# EasyEDA Pro project ProPrj_EasyHub r2.epro

# Schematic Schematic1
Board Name: Board1; Create Date: 2026-01-28; Page Name: P1; Project Name: EasyHub; Schematic Name: Schematic1; Update Date: 2026-01-28; Company: EasyEDA.com; Page Size: A4; Version: V1.0
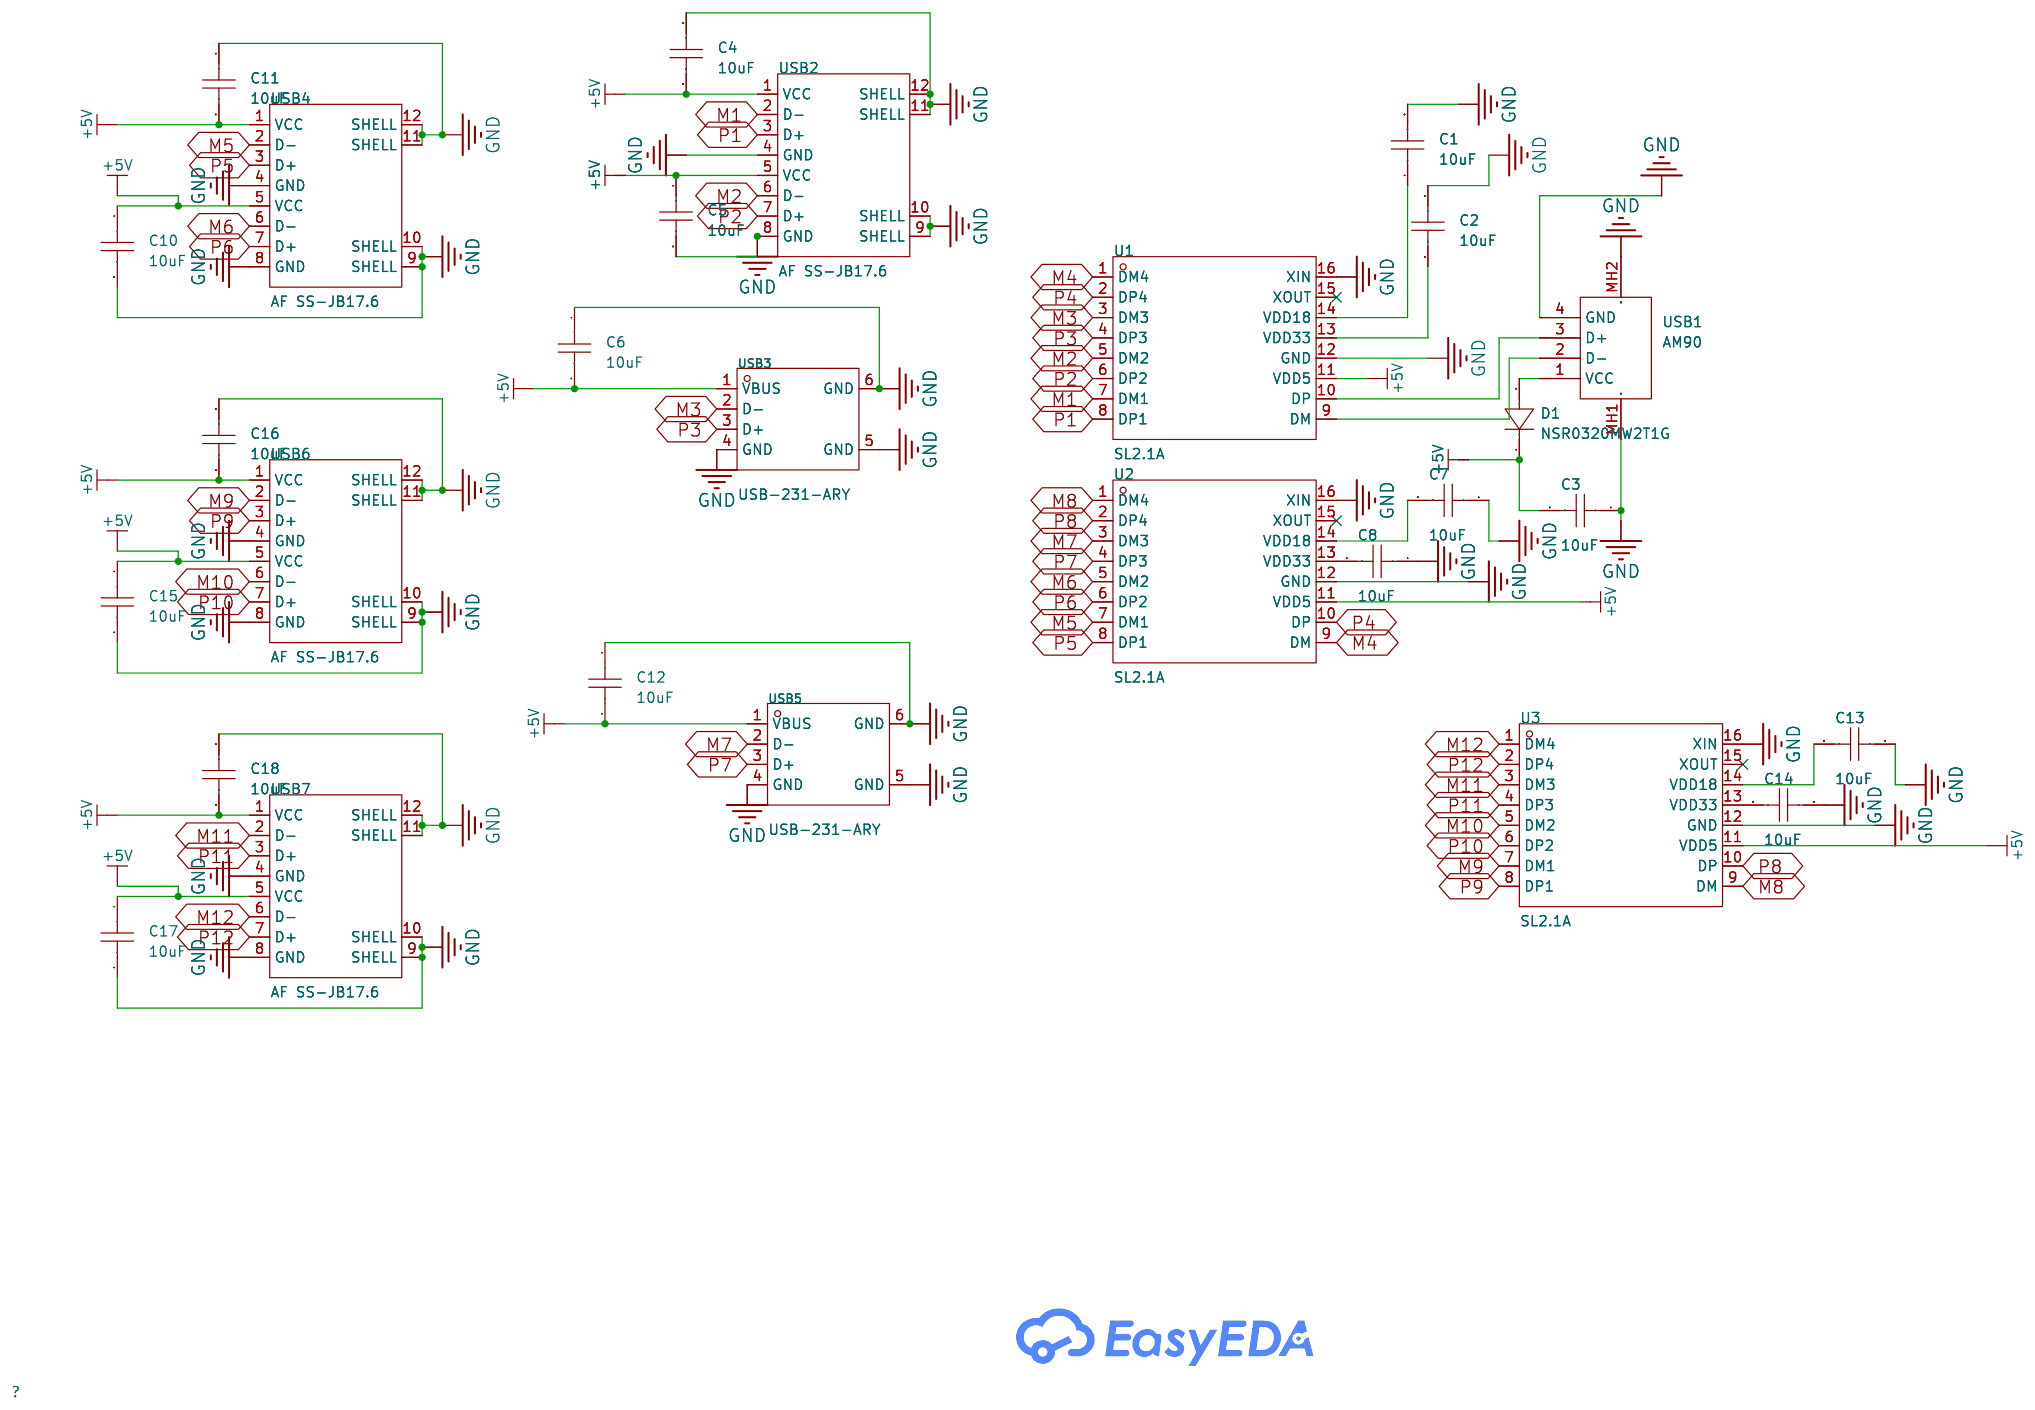
[diagram p0: schematic sheet]

## Parts
C1  10uF  [C0603]
C2  10uF  [C0603]
C3  10uF  [C0603]
C4  10uF  [C0603]
C5  10uF  [C0603]
C6  10uF  [C0603]
C7  10uF  [C0603]
C8  10uF  [C0603]
C10  10uF  [C0603]
C11  10uF  [C0603]
C12  10uF  [C0603]
C13  10uF  [C0603]
C14  10uF  [C0603]
C15  10uF  [C0603]
C16  10uF  [C0603]
C17  10uF  [C0603]
C18  10uF  [C0603]
D1  NSR0320MW2T1G  [SOD-323_L1.8-W1.3-LS2.5-RD]
U1  SL2.1A  [SOP-16_L10.0-W3.9-P1.27-LS6.0-BL]
U2  SL2.1A  [SOP-16_L10.0-W3.9-P1.27-LS6.0-BL]
U3  SL2.1A  [SOP-16_L10.0-W3.9-P1.27-LS6.0-BL]
USB1  AM90  [USB-AM-TH_AM90]
USB2  AF SS-JB17.6  [USB-A-TH_AF-SS-JB17.6]
USB3  USB-231-ARY  [USB-A-TH_USB-231-ARY]
USB4  AF SS-JB17.6  [USB-A-TH_AF-SS-JB17.6]
USB5  USB-231-ARY  [USB-A-TH_USB-231-ARY]
USB6  AF SS-JB17.6  [USB-A-TH_AF-SS-JB17.6]
USB7  AF SS-JB17.6  [USB-A-TH_AF-SS-JB17.6]

## Library data of the parts
C1-C8 C10-C18 = CL10A106KP8NNNC: Capacitance:10uF Tolerance:±10% Tolerance:±10% Voltage Rating:10V Temperature Coefficient:X5R; LCSC Part Name: 10uF ±10% 10V; Supplier Part: C19702; Manufacturer: SAMSUNG(三星); Supplier Footprint: 0603; JLCPCB Part Class: Basic Part; Datasheet: https://item.szlcsc.com/datasheet/CL10A106KP8NNNC/20411.html; Supplier: LCSC; Tolerance: ±10%; Voltage Rating: 10V; Temperature Coefficient: X5R
D1 = NSR0320MW2T1G: Voltage - Forward(Vf@If):500mV@900mA Voltage - DC Reverse(Vr):20V Current - Rectified:1A Reverse Leakage Current (Ir):50uA@15V Operating Junction Temperature Range:-55℃~+125℃ Operating Junction Temperature Range:-55℃~+125℃ Non-Repetitive Peak Forward Surg; LCSC Part Name: 电压:20V 电流:1A; Supplier Part: C48192; Manufacturer: onsemi(安森美); Supplier Footprint: SOD-323; JLCPCB Part Class: Extended Part; Datasheet: https://item.szlcsc.com/datasheet/NSR0320MW2T1G/49199.html; Supplier: LCSC; Voltage - Forward(Vf@If): 500mV@900mA; Voltage - DC Reverse(Vr): 20V; Current - Rectified: 1A; Reverse Leakage Current (Ir): 50uA@15V; Operating Junction Temperature Range: -55℃~+125℃; Non-Repetitive Peak Forward Surge Current: 5A
U1-U3 = SL2.1A_C6798314: Supplier Part: C6798314; Manufacturer: CoreChips(和芯润德); Supplier Footprint: SOP-16; JLCPCB Part Class: Extended Part; Datasheet: https://item.szlcsc.com/datasheet/SL2.1A/7757919.html; Supplier: LCSC
USB1 = AM90: Connector Type:Type-A Protocol Standard:USB 2.0 Gender:Male Mounting Type:Right Angle Number of Contacts:4P Number of Ports:1 Current Rating-Power:1.5A Voltage Rating:30V Connect-Disconnect Life:5,000 times Supplementary Features:- Center Height:- Length:; LCSC Part Name: Type-A弯插公头; Supplier Part: C404965; Manufacturer: SHOU HAN(首韩); Supplier Footprint: 弯插; JLCPCB Part Class: Extended Part; Datasheet: https://item.szlcsc.com/datasheet/AM90/392530.html; Supplier: LCSC; Connector Type: Type-A; Protocol Standard: USB 2.0; Gender: Male; Mounting Type: Right Angle; Number of Contacts: 4P; Number of Ports: 1; Current Rating-Power: 1.5A; Voltage Rating: 30V; Connect-Disconnect Life: 5,000 times; Length: 18.8mm; Detection color: White; Operating Temperature: -25℃~+85℃
USB2 USB4 USB6 USB7 = AF SS-JB17.6: Connector Type:Type-A Protocol Standard:USB 2.0 Gender:Female Mounting Type:Right Angle Number of Contacts:4Px2 Number of Ports:2 Current Rating-Power:1.5A Voltage Rating:30V Connect-Disconnect Life:5,000 times Supplementary Features:- Center Height:- Len; LCSC Part Name: Type-A弯插双层母座; Supplier Part: C456021; Manufacturer: SHOU HAN(首韩); Supplier Footprint: 弯插; JLCPCB Part Class: Extended Part; Datasheet: https://item.szlcsc.com/datasheet/AF%2520SS-JB17.6/458828.html; Supplier: LCSC; Connector Type: Type-A; Protocol Standard: USB 2.0; Gender: Female; Mounting Type: Right Angle; Number of Contacts: 4Px2; Number of Ports: 2; Current Rating-Power: 1.5A; Voltage Rating: 30V; Connect-Disconnect Life: 5,000 times; Length: 17.6mm; Detection color: White; Operating Temperature: -25℃~+85℃
USB3 USB5 = USB-231-ARY: Connector Type:Type-A Protocol Standard:USB 2.0 Gender:Female Mounting Type:Right Angle Number of Contacts:4P Number of Ports:1 Current Rating-Power:1.5A Voltage Rating:30V Length:14.2mm Detection color:White Operating Temperature:-20℃~+70℃ Operating Temp; LCSC Part Name: Type-A 母 弯插; Supplier Part: C720525; Manufacturer: XUNPU(讯普); Supplier Footprint: 弯插; JLCPCB Part Class: Extended Part; Datasheet: https://item.szlcsc.com/datasheet/USB-231-ARY/763532.html; Supplier: LCSC; Connector Type: Type-A; Protocol Standard: USB 2.0; Gender: Female; Mounting Type: Right Angle; Number of Contacts: 4P; Number of Ports: 1; Current Rating-Power: 1.5A; Voltage Rating: 30V; Length: 14.2mm; Detection color: White; Operating Temperature: -20℃~+70℃

## Nets
+5V: C3.2 C4.2 C5.1 C6.2 C10.1 C11.2 C12.2 C15.1 C16.2 C17.1 C18.2 D1.1(K) U1.11(VDD5) U2.11(VDD5) U3.11(VDD5) USB2.1(VCC) USB2.5(VCC) USB3.1(VBUS) USB4.1(VCC) USB4.5(VCC) USB5.1(VBUS) USB6.1(VCC) USB6.5(VCC) USB7.1(VCC) USB7.5(VCC)
GND: C1.2 C2.1 C3.1 C4.1 C5.2 C6.1 C7.1 C8.1 C10.2 C11.1 C12.1 C13.1 C14.1 C15.2 C16.1 C17.2 C18.1 U1.12(GND) U1.16(XIN) U2.12(GND) U2.16(XIN) U3.12(GND) U3.16(XIN) USB1.4(GND) USB1.MH1 USB1.MH2 USB2.4(GND) USB2.8(GND) USB2.9(SHELL) USB2.10(SHELL) USB2.11(SHELL) USB2.12(SHELL) USB3.4(GND) USB3.5(GND) USB3.6(GND) USB4.4(GND) USB4.8(GND) USB4.9(SHELL) USB4.10(SHELL) USB4.11(SHELL) USB4.12(SHELL) USB5.4(GND) USB5.5(GND) USB5.6(GND) USB6.4(GND) USB6.8(GND) USB6.9(SHELL) USB6.10(SHELL) USB6.11(SHELL) USB6.12(SHELL) USB7.4(GND) USB7.8(GND) USB7.9(SHELL) USB7.10(SHELL) USB7.11(SHELL) USB7.12(SHELL)
M1: U1.7(DM1) USB2.2(D-)
M2: U1.5(DM2) USB2.6(D-)
M3: U1.3(DM3) USB3.2(D-)
M4: U1.1(DM4) U2.9(DM)
M5: U2.7(DM1) USB4.2(D-)
M6: U2.5(DM2) USB4.6(D-)
M7: U2.3(DM3) USB5.2(D-)
M8: U2.1(DM4) U3.9(DM)
M9: U3.7(DM1) USB6.2(D-)
M10: U3.5(DM2) USB6.6(D-)
M11: U3.3(DM3) USB7.2(D-)
M12: U3.1(DM4) USB7.6(D-)
P1: U1.8(DP1) USB2.3(D+)
P2: U1.6(DP2) USB2.7(D+)
P3: U1.4(DP3) USB3.3(D+)
P4: U1.2(DP4) U2.10(DP)
P5: U2.8(DP1) USB4.3(D+)
P6: U2.6(DP2) USB4.7(D+)
P7: U2.4(DP3) USB5.3(D+)
P8: U2.2(DP4) U3.10(DP)
P9: U3.8(DP1) USB6.3(D+)
P10: U3.6(DP2) USB6.7(D+)
P11: U3.4(DP3) USB7.3(D+)
P12: U3.2(DP4) USB7.7(D+)
$1N764: U1.10(DP) USB1.3(D+)
$1N770: U1.9(DM) USB1.2(D-)
$1N1165: C1.1 U1.14(VDD18)
$1N1196: C2.2 U1.13(VDD33)
$1N1363: D1.2(A) USB1.1(VCC)
$1N2180: C7.2 U2.14(VDD18)
$1N2340: C8.2 U2.13(VDD33)
$1N5208: C14.2 U3.13(VDD33)
$1N5214: C13.2 U3.14(VDD18)

Not connected (* = marked no-connect by the designer): U1 15(XOUT)*; U2 15(XOUT)*; U3 15(XOUT)*

# Board PCB1
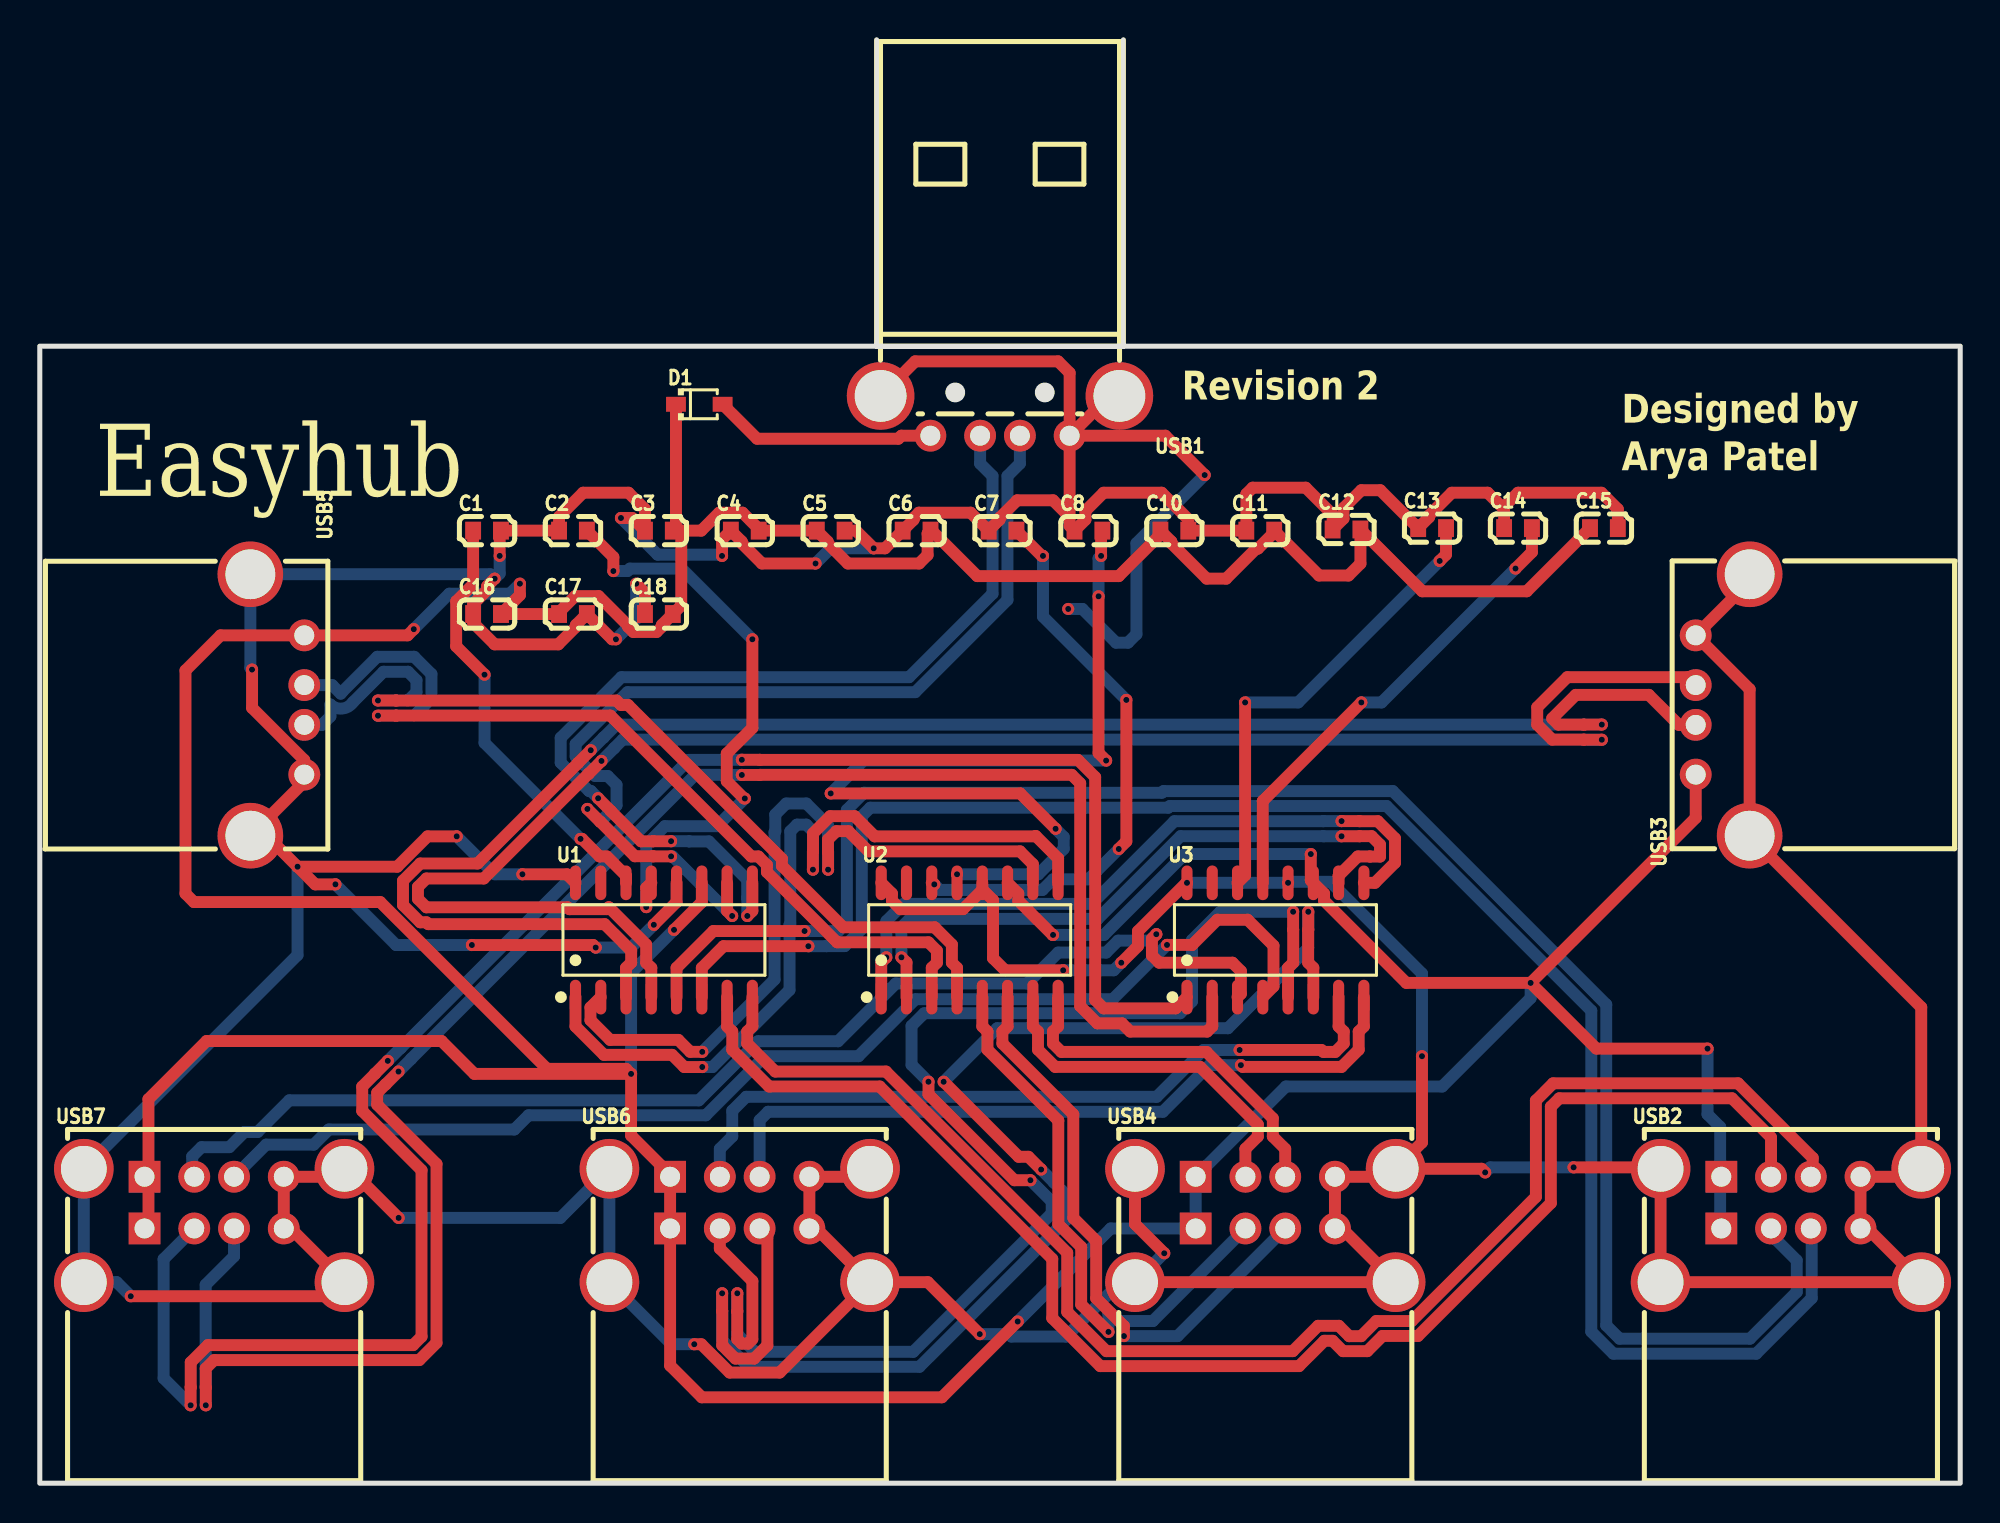
[diagram p1: board, top side]
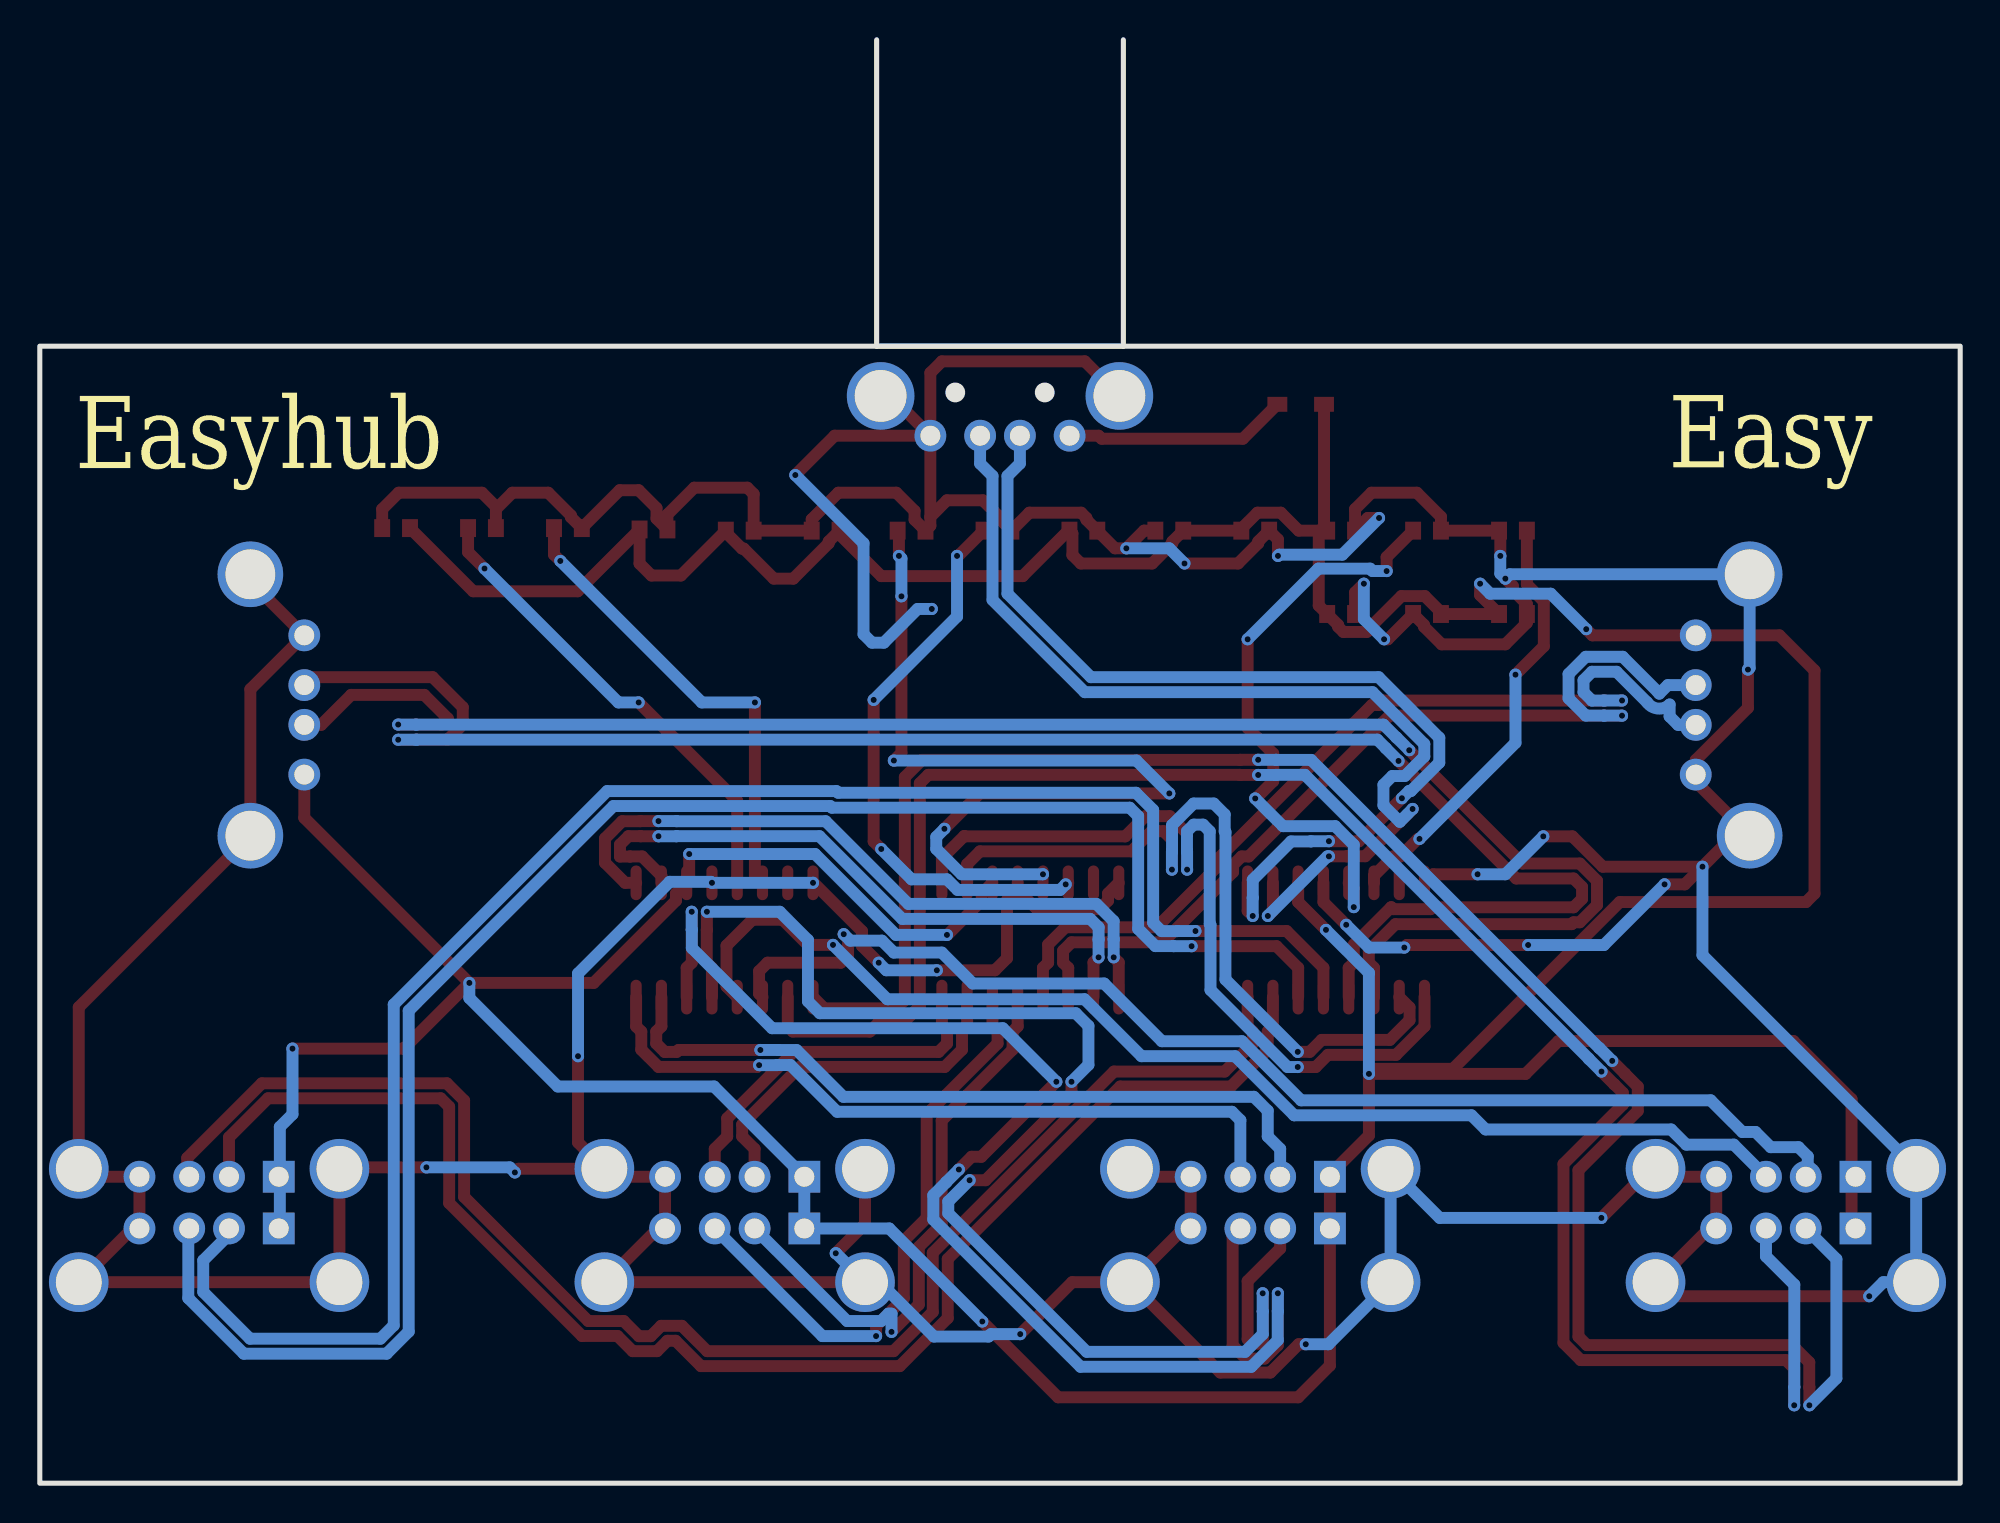
[diagram p2: board, bottom side, seen from below]

Outline 96.52 x 72.55 mm; copper layers: Top Layer, Bottom Layer. Coordinates in mm from the lower left corner of the outline.
Outline path: rectangle 0,57.15 96.52,0
Stack: Top Layer 0.035mm / Dielectric1 1.51mm FR4 er 4.5 / Bottom Layer 0.035mm

## Design rules (mm)
net M4: DP14
net P4: DP14
net M3: DP12
net P3: DP12
net M2: DP9
net P2: DP9
net M1: DP8
net P1: DP8
net $1N764: DP13
net $1N770: DP13
net M8: DP5
net P8: DP5
net M7: DP4
net P7: DP4
net M6: DP3
net P6: DP3
net M5: DP2
net P5: DP2
net M12: DP11
net P12: DP11
net M11: DP10
net P11: DP10
net M10: DP7
net P10: DP7
net M9: DP6
net P9: DP6
template: Custom Config
spacing copperThickness1oz (default): track to track 0.102, other pairs 0.152 to 0.3
spacing copperThickness2oz: track to track 0.203, other pairs 0.152 to 0.3
track width copperThickness1oz (default): min 0.127, default 0.254, max 2.54
track width copperThickness2oz: min 0.203, default 0.254, max 2.54
differential pair differentialPair (default): width min 0.127, default 0.254, max 2.54; gap min 0.152, default 0.152
via viaSize (default): diameter min 0.5, default 0.61, max 10; hole min 0.3, default 0.305, max 6.3

## Placement (name value [footprint] x y rotation side)
C1  10uF  [C0603]  22.48 47.88 0 top
C2  10uF  [C0603]  26.8 47.88 0 top
C3  10uF  [C0603]  31.12 47.88 0 top
C4  10uF  [C0603]  35.43 47.88 0 top
C5  10uF  [C0603]  39.75 47.88 0 top
C6  10uF  [C0603]  44.07 47.88 0 top
C7  10uF  [C0603]  48.39 47.88 0 top
C8  10uF  [C0603]  52.71 47.88 0 top
C10  10uF  [C0603]  57.02 47.88 0 top
C11  10uF  [C0603]  61.34 47.88 0 top
C12  10uF  [C0603]  65.68 47.94 0 top
C13  10uF  [C0603]  69.98 48.01 0 top
C14  10uF  [C0603]  74.3 48.01 0 top
C15  10uF  [C0603]  78.61 48.01 0 top
C16  10uF  [C0603]  22.48 43.69 0 top
C17  10uF  [C0603]  26.8 43.69 0 top
C18  10uF  [C0603]  31.12 43.69 0 top
D1  NSR0320MW2T1G  [SOD-323_L1.8-W1.3-LS2.5-RD]  33.15 54.23 0 top
U1  SL2.1A  [SOP-16_L10.0-W3.9-P1.27-LS6.0-BL]  31.37 27.3 0 top
U2  SL2.1A  [SOP-16_L10.0-W3.9-P1.27-LS6.0-BL]  46.74 27.3 0 top
U3  SL2.1A  [SOP-16_L10.0-W3.9-P1.27-LS6.0-BL]  62.1 27.3 0 top
USB1  AM90  [USB-AM-TH_AM90]  48.26 53.65 180 top
USB2  AF SS-JB17.6  [USB-A-TH_AF-SS-JB17.6]  88.01 12.95 0 top
USB3  USB-231-ARY  [USB-A-TH_USB-231-ARY]  84.58 39.12 90 top
USB4  AF SS-JB17.6  [USB-A-TH_AF-SS-JB17.6]  61.59 12.95 0 top
USB5  USB-231-ARY  [USB-A-TH_USB-231-ARY]  11.94 39.12 270 top
USB6  AF SS-JB17.6  [USB-A-TH_AF-SS-JB17.6]  35.18 12.95 0 top
USB7  AF SS-JB17.6  [USB-A-TH_AF-SS-JB17.6]  8.76 12.95 0 top

## Footprints (pads in the part's own frame, mm; a bottom-side part is the same pattern mirrored in y, then rotated)
C0603
  rect 0.8x0.9 smd: 1(-0.7,0) 2(0.7,0)
SOD-323_L1.8-W1.3-LS2.5-RD
  rect 1x0.75 smd: 1(-1.173,0) 2(1.173,0)
SOP-16_L10.0-W3.9-P1.27-LS6.0-BL
  oval 0.56x1.745 smd: 1(-4.445,-2.873) 2(-3.175,-2.873) 3(-1.905,-2.873) 4(-0.635,-2.873) 5(0.635,-2.873) 6(1.905,-2.873) 7(3.175,-2.873) 8(4.445,-2.873) 9(4.445,2.873) 10(3.175,2.873) 11(1.905,2.873) 12(0.635,2.873) 13(-0.635,2.873) 14(-1.905,2.873) 15(-3.175,2.873) 16(-4.445,2.873)
USB-A-TH_AF-SS-JB17.6
  rect 1.6x1.6 hole 1: 1(-3.5,2.45) 5(-3.5,-0.15)
  round 1.6 hole 1: 2(-1,2.45) 3(1,2.45) 4(3.5,2.45) 6(-1,-0.15) 7(1,-0.15) 8(3.5,-0.15)
  round 3 hole 2.3: 9(-6.55,2.85) 10(6.55,2.85) 11(-6.55,-2.85) 12(6.55,-2.85)
USB-A-TH_USB-231-ARY
  round 1.6 hole 1: 1(-3.5,1.355) 2(-1,1.355) 3(1,1.355) 4(3.5,1.355)
  round 3.3 hole 2.5: 5(-6.57,-1.355) 6(6.57,-1.355)
USB-AM-TH_AM90
  round 1.6 hole 1: 1(3.5,1) 2(1,1) 3(-1,1) 4(-3.5,1)
  round 3.4 hole 2.6: MH1(6,-1) MH2(-6,-1)

## Nets
As in the schematic.

Pads without a net: U1 15; U2 15; U3 15

## Via types
v1: diameter 0.61, hole 0.305, Top Layer to Bottom Layer, 101 vias

## Routing (per net, layer and track width the routed paths; a pad name or vN(x,y) marks a point on that pad's centre or on a via; arc(x,y) is an arc through that point)
+5V: length 317.7
  Top Layer w0.6: v1(24.13,45.21) 24.13,44.64 C16.2 C17.1 26.1,43.78 26.91,44.59 28.08,44.59 29.56,43.11 29.56,43.05 29.83,42.79 31,42.79 31.27,43.05 31.27,43.14 C18.2 32.24,44.11 32.24,47.88 ; v1(74.93,25.15) 68.68,25.15 64.55,29.28 64.55,29.64 U3.11 63.88,30.3 v1(63.88,31.62) ; v1(74.93,25.15) 83.23,33.44 USB3.1 ; v1(74.93,25.15) 78.23,21.84 v1(83.82,21.84) ; C15.1 74.74,44.83 69.48,44.83 C12.2 66.38,46.22 65.78,45.62 64.3,45.62 C11.2 62.04,47.79 61.23,46.98 61.14,46.98 59.63,45.47 58.65,45.47 56.87,47.24 56.87,47.33 C10.1 56.32,47.69 54.23,45.59 47.12,45.59 44.83,47.88 C6.2 44.62,47.73 44.62,46.65 44.2,46.23 40.61,46.23 39.6,47.24 39.6,47.33 C5.1 C4.2 36.13,47.97 35.32,48.78 34.15,48.78 33.24,47.88 32.24,47.88 ; 32.24,47.88 C3.2 31.97,48.04 D1.1 ; v1(29.72,20.57) 29.72,17.48 31.68,15.51 USB6.5 31.68,5.91 33.27,4.32 45.34,4.32 v1(49.15,8.13) ; v1(29.72,20.57) 21.84,20.57 20.19,22.22 8.38,22.22 5.46,19.3 5.46,13 USB7.5 ; v1(29.72,20.57) 29.46,20.83 25.49,20.83 17.11,29.21 7.75,29.21 7.32,29.63 7.32,40.85 9.09,42.62 USB5.1 18.49,42.62 v1(18.8,42.93) ; 48.64,30.18 49.18,29.64 49.18,29.28 50.9,27.56 v1(50.93,27.56) ; U1.11 33.27,29.21 v1(31.88,27.81)
  Bottom Layer w0.6: v1(31.88,27.81) 29.72,25.65 v1(29.72,20.57) ; v1(18.8,42.93) 20.58,44.71 23.63,44.71 v1(24.13,45.21) ; v1(83.82,21.84) 83.82,18.54 84.46,17.91 84.46,12.86 USB2.5 ; v1(50.93,27.56) 53.49,27.56 57.55,31.62 v1(63.88,31.62) ; v1(49.15,8.13) 53.83,12.8 USB4.5 58.09,15.4 62.63,19.94 70.49,19.94 74.93,24.38 v1(74.93,25.15)
GND: length 476.7
  Top Layer w0.6: 73.59,48.96 73.59,49.08 74.3,49.78 78.49,49.78 79.31,48.96 C15.2 ; 73.59,48.96 72.77,49.78 70.97,49.78 69.83,48.64 69.83,48.55 C13.1 67.37,49.91 66.42,49.91 65.52,49.01 65.52,48.48 C12.1 64.98,48.69 63.63,50.04 60.96,50.04 60.64,49.72 60.64,47.88 57.72,47.88 57.72,48.45 56.39,49.78 53.47,49.78 52.55,48.87 52.55,48.43 52,47.88 51.76,48.12 51.76,48.57 ; 73.59,48.96 C14.1 ; USB1.4 53.76,54.65 USB1.MH2 ; USB1.4 51.76,55.81 51.18,56.39 44,56.39 USB1.MH1 ; USB1.4 51.76,48.57 ; USB1.4 56.57,52.65 v1(58.55,50.67) ; v1(29.21,48.51) 29.78,48.51 30.41,47.88 30.41,48.96 29.59,49.78 27.31,49.78 26.1,48.58 C2.1 C1.2 23.11,47.81 v1(23.11,46.61) ; C5.2 41.02,47.88 v1(41.91,46.99) 42.48,46.99 43.92,48.43 43.92,48.52 44.18,48.78 46.78,48.78 C7.1 48.24,48.43 48.24,48.52 49.12,49.4 50.93,49.4 51.76,48.57 ; v1(12.95,30.99) 11.4,32.55 USB5.6 13.29,35.26 USB5.4 13.29,36.35 10.67,38.97 v1(10.67,40.89) ; v1(12.95,30.99) 13.84,30.1 v1(14.86,30.1) ; v1(12.95,30.99) 17.97,30.99 19.49,32.51 v1(20.95,32.51) ; USB4.10 72.46,15.8 v1(72.64,15.62) ; USB4.10 67.75,15.4 65.09,15.4 65.09,13.15 USB4.12 USB4.11 ; USB4.10 69.47,17.13 v1(69.47,21.46) ; v1(21.72,27.05) 27.81,27.05 v1(27.94,26.92) ; v1(57.66,30.18) 57.63,30.18 55.19,27.74 55.19,27 v1(54.36,26.16) ; USB6.12 44.63,10.1 v1(47.24,7.49) ; USB6.12 38.68,13.15 38.68,15.4 41.33,15.4 USB6.10 ; USB6.12 37.19,5.56 34.67,5.56 33.25,6.98 v1(32.89,6.98) ; U2.12 47.37,29.84 ; 47.37,29.84 47.91,29.31 47.91,26.39 48.51,25.78 v1(51.44,25.78) ; 47.37,29.84 47.37,29.82 46.4,28.85 43.26,28.85 42.83,29.28 42.83,29.64 U2.16 ; 30.41,43.69 30.41,44.77 v1(29.97,45.21) ; USB4.9 55.05,13.03 v1(56.52,11.56) ; 85.94,45.69 85.94,45.33 USB3.4 85.94,39.91 USB3.5 94.56,23.92 USB2.10 94.16,15.4 91.51,15.4 91.51,13.15 USB2.12 USB2.11 USB2.9 81.39,15.87 v1(77.09,15.87) ; U1.16 26.49,30.61 v1(24.26,30.61) ; v1(30.86,28.07) 32,29.21 U1.12 ; v1(28.96,42.42) 28.77,42.42 27.5,43.69 26.95,43.14 26.95,43.05 26.06,42.16 22.86,42.16 21.78,43.24 21.78,44.18 22.48,44.89 22.48,45.09 v1(22.86,45.47) ; v1(34.29,46.61) 34.29,47.44 C4.1 35.28,47.33 35.28,47.24 36.3,46.23 v1(38.99,46.23) ; v1(18.03,13.33) 15.56,15.8 USB7.10 14.91,15.4 12.26,15.4 12.26,13.15 USB7.12 14.61,9.4 v1(4.57,9.4)
  Bottom Layer w0.6: v1(58.55,50.67) 55.12,47.24 55.12,42.67 54.69,42.25 54.09,42.25 52.4,43.94 v1(51.69,43.94) ; v1(38.99,46.23) 39.75,46.99 v1(41.91,46.99) ; v1(34.29,46.61) 34.23,46.67 31.05,46.67 v1(29.21,48.51) ; v1(77.09,15.87) 72.9,15.87 v1(72.64,15.62) ; v1(21.72,27.05) 17.91,27.05 v1(14.86,30.1) ; v1(30.86,28.07) 29.72,26.92 v1(27.94,26.92) ; v1(29.97,45.21) 29.97,43.43 v1(28.96,42.42) ; v1(23.11,46.61) 23.11,45.72 v1(22.86,45.47) 22.64,45.69 10.58,45.69 10.58,40.98 v1(10.67,40.89) ; v1(20.95,32.51) 22.86,30.61 v1(24.26,30.61) ; v1(32.89,6.98) 31.75,6.98 USB6.11 USB6.9 26.16,13.33 v1(18.03,13.33) ; v1(69.47,21.46) 69.47,25.62 64.86,30.23 62.79,30.23 v1(62.74,30.18) v1(57.66,30.18) ; v1(54.36,26.16) 53.97,25.78 v1(51.44,25.78) ; v1(12.95,30.99) 12.95,26.54 USB7.9 USB7.11 3.87,10.1 v1(4.57,9.4) ; v1(47.24,7.49) 48.71,7.49 48.84,7.37 51.58,7.37 54.31,10.1 USB4.11 56.5,11.56 v1(56.52,11.56)
M1: length 74.9
  Top Layer w0.6: 87.01,15.4 87.01,17.38 85.05,19.35 76.37,19.35 75.95,18.92 75.95,14.08 69.27,7.4 67.48,7.4 66.72,6.64 65.5,6.64 64.98,7.16 64.56,7.16 63.29,5.89 53.3,5.89 50.89,8.3 50.89,11.27 42.22,19.94 36.65,19.94 34.8,21.79 34.8,22.7 34.54,22.96 U1.7
M2: length 90.3
  Top Layer w0.6: U1.5 32,25.9 33.85,27.75 v1(38.44,27.75)
  Bottom Layer w0.6: v1(38.44,27.75) 39.34,27.75 39.35,27.75 40.14,27.75 40.56,28.17 40.56,33.84 41.43,34.7 56.4,34.7 56.48,34.79 68,34.79 78.73,24.06 78.73,7.93 79.4,7.26 85.96,7.26 88.3,9.61 88.3,11.2 87.01,12.49 USB2.6
M3: length 90.5
  Top Layer w0.6: U1.3 29.46,25.9 29.72,26.16 29.72,26.76 28.39,28.1 19.52,28.1 19.43,28.19 19.12,28.19 18.25,29.06 18.25,30.28 19.12,31.15 22,31.15 27.05,36.19 27.05,36.2 v1(27.69,36.84) ; USB3.2 82.38,38.12 80.87,39.62 77.2,39.62 76.01,38.44 76.33,38.13 77.6,38.13 77.6,38.13 v1(78.51,38.13)
  Bottom Layer w0.6: v1(78.51,38.13) 77.6,38.13 77.6,38.13 28.98,38.13 28.34,37.48 28.33,37.48 v1(27.69,36.84)
M4: length 42.6
  Top Layer w0.6: v1(33.3,20.92) 32.39,20.92 31.78,21.53 28.35,21.53 26.92,22.96 U1.1 ; U2.9 51.18,31.41 50.06,32.53 50.04,32.51 41.97,32.51 40.95,33.53 39.73,33.53 38.86,32.66 38.86,31.75 38.86,31.74 v1(38.86,30.84)
  Bottom Layer w0.6: v1(33.3,20.92) 33.81,20.92 37.68,24.79 37.68,28.07 37.72,28.11 37.72,32.77 38.05,33.1 38.53,33.1 38.86,32.77 38.86,31.75 38.86,31.74 v1(38.86,30.84)
M5: length 18.2
  Top Layer w0.6: U2.7 49.91,22.96 50.17,22.7 50.17,21.79 51.03,20.92 58.32,20.92 61.22,18.03 61.22,17.43 60.59,16.8 60.59,15.4
M6: length 29.3
  Top Layer w0.6: U2.5 47.37,22.96 47.63,22.7 47.63,21.79 51.19,18.23 51.19,13.02 52.34,11.87 52.34,8.98 v1(53.71,7.61)
  Bottom Layer w0.6: USB4.6 55.94,8.15 54.24,8.15 53.87,8.52 53.72,8.52 53.71,8.51 v1(53.71,7.61)
M7: length 47.6
  Top Layer w0.6: U2.3 44.83,25.9 45.09,26.16 45.09,26.76 44.67,27.19 40.07,27.19 36.55,30.72 36.55,31.07 36.12,31.5 35.76,31.5 28.68,38.58 17.91,38.58 17.9,38.58 v1(17,38.58)
  Bottom Layer w0.6: v1(17,38.58) 17.9,38.58 17.91,38.58 18.82,38.58 19.68,39.45 19.68,40.67 18.82,41.54 16.96,41.54 15.21,39.78 arc(15.16,39.74) 15.12,39.68 14.69,40.12 USB5.2
M8: length 35.1
  Top Layer w0.6: U3.9 67.1,30.18 68.11,31.19 68.11,32.41 67.25,33.27 66.34,33.27 66.33,33.28 v1(65.43,33.28) ; U2.1 42.29,26.18 v1(42.55,26.43)
  Bottom Layer w0.6: v1(65.43,33.28) 64.52,33.28 64.52,33.27 57.02,33.27 52.87,29.12 43.41,29.12 42.55,28.25 42.55,27.34 42.55,27.34 v1(42.55,26.43)
M9: length 38.2
  Top Layer w0.6: U3.7 65.28,22.96 65.54,22.7 65.54,22.1 65.11,21.68 64.51,21.68 64.41,21.78 v1(60.3,21.78)
  Bottom Layer w0.6: v1(60.3,21.78) 59.4,21.78 59.39,21.77 58.48,21.77 56.13,19.42 35.5,19.42 34.8,18.72 34.8,17.43 34.18,16.8 34.18,15.4
M10: length 71.2
  Top Layer w0.6: USB6.6 34.18,11.79 35.81,10.16 35.81,7.24 35.59,7.02 35.28,7.02 35.05,7.24 35.05,8.64 35.06,8.64 v1(35.06,9.55) ; v1(62.99,28.72) 62.99,27.82 63,27.81 63,26.16 62.74,25.9 U3.5 ; v1(49.79,15.23) 48.99,15.23 44.67,19.55 v1(44.67,20.18)
  Bottom Layer w0.6: v1(35.06,9.55) 35.06,8.64 35.05,8.64 35.05,7.49 35.94,6.6 43.9,6.6 50.86,13.56 50.86,14.16 v1(49.79,15.23) ; v1(44.67,20.18) 43.81,21.03 43.81,22.99 44.45,23.62 57.31,23.62 57.91,24.22 57.91,27.3 59.33,28.72 v1(62.99,28.72)
M11: length 61.5
  Top Layer w0.6: U3.3 60.37,24.6 60.37,25.74 59.94,26.16 56.26,26.16 55.9,26.53 55.9,27.37 56.12,27.59 v1(56.12,27.59)
  Bottom Layer w0.6: 7.76,15.4 7.66,15.51 7.66,16.42 8.13,16.89 9.53,16.89 10.29,17.65 10.95,17.65 12.54,19.24 33.13,19.24 36.1,22.22 40.12,22.22 43.02,25.12 49.63,25.12 51.18,26.67 53.59,26.67 54.19,27.27 55.79,27.27 v1(56.12,27.59)
M12: length 98.4
  Top Layer w0.6: v1(17.49,21.23) 16.85,20.59 16.85,20.58 16.21,19.94 16.21,18.71 19.19,15.73 19.19,7.37 18.76,6.94 8.45,6.94 7.59,6.08 7.59,4.83 7.58,4.82 v1(7.58,3.92) ; U3.1 57.09,23.87 53.47,23.87 53.04,24.29 53.04,35.49 52.18,36.36 36.19,36.36 36.19,36.36 v1(35.28,36.36)
  Bottom Layer w0.6: v1(17.49,21.23) 18.13,21.87 18.14,21.87 32.62,36.36 34.38,36.36 34.38,36.36 v1(35.28,36.36) ; v1(7.58,3.92) 6.22,5.27 6.22,11.26 USB7.6
P1: length 75.5
  Top Layer w0.6: 89.01,15.4 89.11,15.5 89.11,16.35 85.36,20.1 76.06,20.1 75.19,19.23 75.19,14.39 68.95,8.15 67.17,8.15 66.41,7.39 65.81,7.39 65.29,7.91 64.25,7.91 62.98,6.64 53.61,6.64 51.64,8.61 51.64,11.58 42.53,20.69 36.97,20.69 35.56,22.1 35.56,22.7 35.81,22.96 U1.8
P2: length 89.5
  Top Layer w0.6: v1(38.63,26.99) 34.36,26.99 33.27,25.9 U1.6
  Bottom Layer w0.6: USB2.7 89.06,12.76 89.06,9.3 86.27,6.51 79.09,6.51 77.98,7.62 77.98,23.75 67.69,34.04 56.79,34.04 56.71,33.95 41.74,33.95 41.32,33.53 41.32,27.86 40.45,27 39.54,27 39.53,26.99 v1(38.63,26.99)
P3: length 91.6
  Top Layer w0.6: U1.4 30.73,25.9 30.47,26.16 30.47,27.08 28.6,28.95 28.59,28.95 28.5,28.85 26.62,28.85 26.53,28.95 19.43,28.95 19.01,29.37 19.01,29.97 19.43,30.39 22.31,30.39 27.58,35.66 27.59,35.66 v1(28.23,36.3) ; USB3.3 82.83,40.51 76.77,40.51 75.26,39 75.26,38.13 76.02,37.37 77.6,37.37 77.6,37.37 v1(78.51,37.37)
  Bottom Layer w0.6: v1(78.51,37.37) 77.6,37.37 77.6,37.37 29.29,37.37 28.87,36.95 28.87,36.94 v1(28.23,36.3)
P4: length 40.3
  Top Layer w0.6: U1.2 27.68,23.91 27.68,23.27 28.67,22.28 32.09,22.28 32.69,21.68 v1(33.3,21.68) ; v1(39.62,30.84) 39.62,31.74 39.61,31.75 39.61,32.35 40.04,32.77 40.64,32.77 41.65,31.76 49.27,31.76 49.91,31.11 U2.10
  Bottom Layer w0.6: v1(33.3,21.68) 36.93,25.31 36.93,32.73 36.97,32.77 36.97,33.61 37.52,34.16 38.53,34.16 39.61,33.08 39.61,31.75 39.62,31.74 v1(39.62,30.84)
P5: length 18.2
  Top Layer w0.6: U2.8 51.18,22.96 50.92,22.7 50.92,22.1 51.35,21.68 58.63,21.68 61.97,18.34 61.97,17.43 62.59,16.8 62.59,15.4
P6: length 30
  Top Layer w0.6: 48.64,24.43 48.64,22.96 48.38,22.7 48.38,22.1 51.94,18.54 51.94,13.33 53.09,12.18 53.09,9.3 54.49,7.9 v1(54.49,7.39)
  Bottom Layer w0.6: v1(54.49,7.39) 57.19,7.39 USB4.7
P7: length 47
  Top Layer w0.6: v1(17,39.34) 17.9,39.34 17.91,39.34 28.99,39.34 29.21,39.12 29.57,39.12 37.3,31.38 37.3,31.03 40.39,27.94 44.98,27.94 45.84,27.08 45.84,26.16 46.1,25.9 46.1,24.43
  Bottom Layer w0.6: USB5.3 14.18,38.12 14.61,38.54 14.61,39.14 arc(15.2,38.94) 15.74,39.25 17.27,40.78 18.51,40.78 18.93,40.36 18.93,39.76 18.51,39.34 17.91,39.34 17.9,39.34 v1(17,39.34)
P8: length 33.2
  Top Layer w0.6: U3.10 65.28,30.53 66.25,31.5 66.85,31.5 66.86,31.5 67.36,31.5 67.36,32.1 66.94,32.52 66.34,32.52 66.33,32.52 v1(65.43,32.52) ; v1(43.31,26.43) 43.56,26.18 U2.2
  Bottom Layer w0.6: v1(65.43,32.52) 64.52,32.52 64.52,32.52 57.33,32.52 53.18,28.36 43.73,28.36 43.3,27.94 43.3,27.34 43.31,27.34 v1(43.31,26.43)
P9: length 37.2
  Top Layer w0.6: U3.8 66.55,22.96 66.29,22.7 66.29,21.79 65.42,20.92 60.46,20.92 v1(60.37,21.01)
  Bottom Layer w0.6: 36.18,15.4 36.18,18.24 36.6,18.67 56.44,18.67 58.79,21.02 59.46,21.02 59.46,21.01 v1(60.37,21.01)
P10: length 71.5
  Top Layer w0.6: v1(50.33,15.77) 49.69,16.41 49.2,16.41 v1(45.43,20.18) ; v1(34.3,9.55) 34.3,8.64 34.3,8.64 34.3,6.93 34.96,6.26 35.9,6.26 36.57,6.93 36.57,12.36 36.43,12.49 ; v1(63.75,28.72) 63.75,27.82 63.75,27.81 63.75,26.16 64.01,25.9 U3.6
  Bottom Layer w0.6: v1(45.43,20.18) 48.12,22.87 59.72,22.87 63.75,26.9 63.75,27.81 63.75,27.82 v1(63.75,28.72) ; v1(50.33,15.77) 50.97,15.13 50.97,15.12 51.61,14.48 51.61,13.25 44.21,5.85 35.63,5.85 34.3,7.18 34.3,8.64 34.3,8.64 v1(34.3,9.55)
P11: length 60.9
  Top Layer w0.6: U3.4 62.01,24.97 62.01,27.02 60.71,28.32 59.18,28.32 57.92,27.06 v1(56.65,27.06)
  Bottom Layer w0.6: v1(56.65,27.06) 53.93,24.33 44.01,24.33 41.15,21.46 36.45,21.46 33.47,18.49 24.56,18.49 23.85,17.78 14.53,17.78 13.77,17.02 11.38,17.02 9.76,15.4
P12: length 99.4
  Top Layer w0.6: v1(35.28,35.6) 36.19,35.6 36.19,35.6 51.87,35.6 52.29,35.18 52.29,23.98 53.16,23.11 54.39,23.11 54.8,22.7 58.67,22.7 58.93,22.96 U3.2 ; v1(18.03,20.69) 17.39,20.05 17.38,20.05 16.96,19.62 16.96,19.02 19.94,16.04 19.94,7.05 19.07,6.19 8.76,6.19 8.34,5.76 8.34,4.83 8.34,4.82 v1(8.34,3.92)
  Bottom Layer w0.6: USB7.7 9.76,11.4 8.34,9.98 8.34,4.83 8.34,4.82 v1(8.34,3.92) ; v1(18.03,20.69) 18.67,21.33 18.67,21.34 32.94,35.6 34.38,35.6 34.38,35.6 v1(35.28,35.6)
$1N764: length 50.9
  Top Layer w0.6: v1(27.52,33.89) 28.16,33.25 28.17,33.25 29.91,31.51 30.82,31.51 30.82,31.51 v1(31.73,31.51) ; v1(34.8,28.51) 34.54,28.76 U1.10
  Bottom Layer w0.6: USB1.3 49.26,51.25 48.64,50.63 48.64,44.4 44,39.76 29.54,39.76 26.93,37.16 26.93,36.53 27.92,35.55 28.54,35.55 28.99,35.1 28.99,34.07 28.17,33.25 28.16,33.25 v1(27.52,33.89) ; v1(31.73,31.51) 31.8,31.51 v1(34.8,28.51)
$1N770: length 49.6
  Top Layer w0.6: v1(28.06,34.43) 28.7,33.79 28.7,33.78 30.22,32.26 30.82,32.26 30.82,32.27 v1(31.73,32.27) ; v1(35.56,28.51) 35.81,28.76 U1.9
  Bottom Layer w0.6: v1(31.73,32.27) 32.63,32.27 32.64,32.26 33.63,32.26 35.56,30.33 35.56,29.42 35.56,29.42 v1(35.56,28.51) ; v1(28.06,34.43) 27.7,34.79 27.6,34.79 26.18,36.22 26.18,37.47 29.23,40.51 43.69,40.51 47.88,44.71 47.88,50.63 47.26,51.25 USB1.2
$1N1165: length 21.8
  Top Layer w0.6: U1.14 29.46,30.53 28.5,31.5 28.14,31.5 27.26,32.38 v1(27.18,32.38) ; 21.78,47.88 21.78,45.18 20.93,44.32 20.93,42.06 v1(22.35,40.64)
  Bottom Layer w0.6: v1(22.35,40.64) 22.35,37.21 v1(27.18,32.38)
$1N1196: length 30.4
  Top Layer w0.6: v1(35.81,42.42) 35.81,37.96 34.53,36.67 34.53,35.28 35.4,34.42 v1(35.43,34.42) ; U1.13 30.48,29.92 v1(30.48,28.96) ; v1(28.83,45.85) 28.83,46.55 27.5,47.88
  Bottom Layer w0.6: v1(35.81,42.42) 32.26,45.97 29.66,45.97 29.54,45.85 v1(28.83,45.85) ; v1(30.48,28.96) 30.48,32.09 31.42,33.03 34.04,33.03 v1(35.43,34.42)
$1N1363: length 11.2
  Top Layer w0.6: D1.2 36.05,52.5 43.15,52.5 43.3,52.65 USB1.1
$1N2180: length 28.9
  Top Layer w0.6: U2.14 44.88,30.18 v1(44.96,30.1) ; v1(54.23,31.88) 54.61,32.26 v1(54.61,39.37) ; 49.09,47.88 50.36,46.61 v1(50.42,46.61)
  Bottom Layer w0.6: v1(44.96,30.1) 45.24,29.82 50.39,29.82 50.93,30.35 52.71,30.35 v1(54.23,31.88) ; v1(50.42,46.61) 50.42,43.56 v1(54.61,39.37)
$1N2340: length 45.4
  Top Layer w0.6: v1(51.05,32.89) 49.28,34.67 v1(39.75,34.67) ; v1(53.34,46.61) 53.34,47.81 C8.2 ; v1(53.21,44.58) 53.21,36.7 v1(53.59,36.32)
  Bottom Layer w0.6: v1(39.75,34.67) 41.4,36.32 v1(53.59,36.32) ; v1(51.05,32.89) 51.46,32.48 51.46,31.88 50.19,30.61 v1(46.1,30.61) ; v1(53.34,46.61) 53.21,46.48 v1(53.21,44.58)
$1N5208: length 24
  Top Layer w0.6: v1(74.17,45.97) 75,46.8 C14.2 ; U3.13 61.47,34.29 v1(66.42,39.24)
  Bottom Layer w0.6: v1(74.17,45.97) 67.44,39.24 v1(66.42,39.24)
$1N5214: length 23.7
  Top Layer w0.6: v1(70.36,46.35) 70.68,46.67 C13.2 ; U3.14 60.58,30.56 v1(60.58,39.24)
  Bottom Layer w0.6: v1(60.58,39.24) 63.25,39.24 v1(70.36,46.35)

## Text on the board
Bottom Silkscreen Layer: Easy | Easyhub
Top Silkscreen Layer: Revision 2 | Designed by / Arya Patel | Easyhub
